# Altium project PCBStudy(LEDLight).PrjPCB
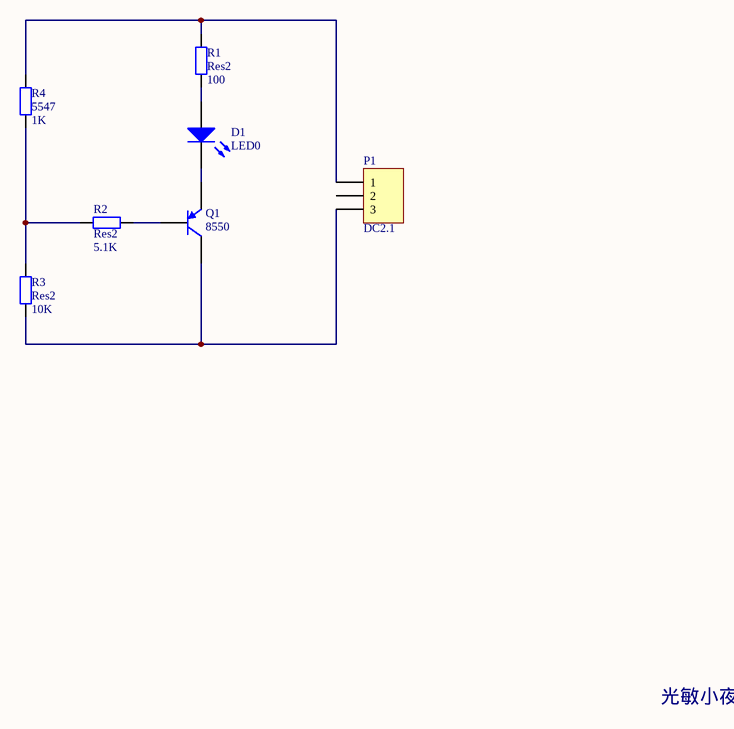
[diagram p0: PCBStudy(LEDLight).SchDoc]
1 sheet, 7 parts. Net scope: global (net labels, ports and power ports of the same name join across sheets).
Board file: PCBStudy(LEDLight).PcbDoc

## Sheet PCBStudy(LEDLight).SchDoc
size A4

### Parts
D1  LED0  [0805]
P1  DC2.1  [DC2.1]
Q1  8550  [SOT-23]
R1  Res2  value 100  [0805]
R2  Res2  value 5.1K  [0805]
R3  Res2  value 10K  [0805]
R4  5547  value 1K  [5547]

### Nets
NetD1_1: D1.1(A) R1.1
NetD1_2: D1.2(K) Q1.3(E)
NetP1_1: P1.1 R1.2 R4.2
NetP1_3: P1.3 Q1.1(C) R3.1
NetQ1_2: Q1.2(B) R2.2
NetR2_1: R2.1 R3.2 R4.1

Not connected (* = marked no-connect by the designer): P1 2

### Notes on the sheet
- 光敏小夜灯

### Library data of the parts
D1 = LED0: Typical INFRARED GaAs LED; Published: 8-Jun-2000; LatestRevisionDate: 08-Jul-2005; LatestRevisionNote: Mech Layer 1 removed.; PackageReference: LED-0; Publisher: Altium Limited
P1 = Header 3: Header, 3-Pin; LatestRevisionDate: 17-Jul-2002; LatestRevisionNote: Re-released for DXP Platform.; Publisher: Altium Limited
Q1 = PNP: PNP Bipolar Transistor; Published: 8-Jun-2000; LatestRevisionDate: 17-Jul-2002; LatestRevisionNote: Re-released for DXP Platform.; PackageReference: SOT-23B; Publisher: Altium Limited; Code_JEDEC: SOT-23
R1-R4 = Res2: Resistor; Published: 8-Jun-2000; LatestRevisionDate: 17-Jul-2002; LatestRevisionNote: Re-released for DXP Platform.; PackageReference: AXIAL-0.4; Publisher: Altium Limited